# EAGLE schematic ControlBoard (EAGLE 9.4.2)
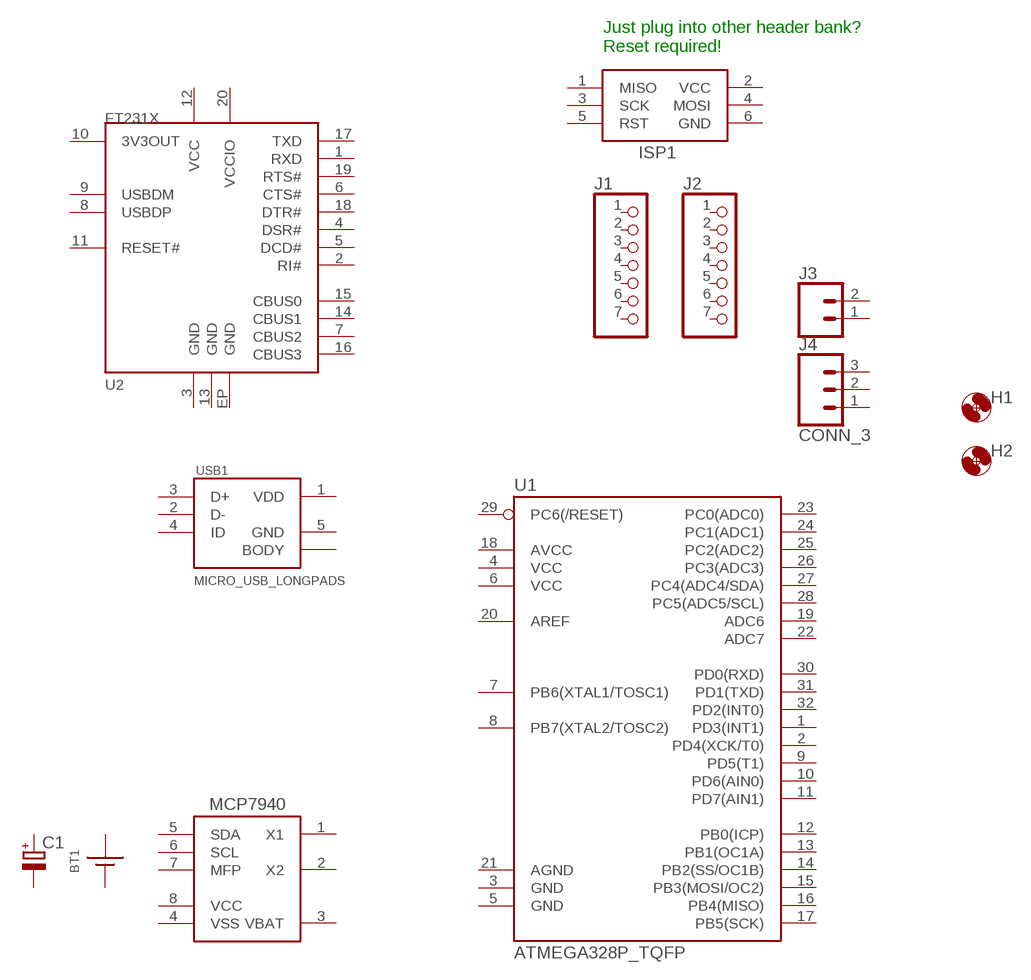
[diagram p0: schematic, sheet 1]

## Parts
BT1  BATTERY_COIN12MM  [LINX_BAT-HLD-012-SMT]
C1  CPOL-EUE2.5-6  [E2,5-6]
H1  MOUNTING_HOLE2_NP  [2_56]
H2  MOUNTING_HOLE2_NP  [2_56]
ISP1  AVRISP-6  [AVRISP]
J1  CONN_7  [1X07]
J2  CONN_7  [1X07]
J3  CONN_02  [1X02]
J4  CONN_3  [1X03]
U1  ATMEGA328P_TQFP  ATMEGA328P_TQFPTQFP_32  [TQFP32-08]
U2  FT231X-Q  [QFN20]
U$1  MCP7940SOIC  [SO08]
USB1  MICRO_USB_LONGPADS  [10118194-0001LF_10118194-0001LF_LONGER_PADS]
Unconnected: BT1.GND(-) BT1.POWER0(+) BT1.POWER1(+) C1.+ C1.- ISP1.1(MISO) ISP1.3(SCK) ISP1.4(MOSI) ISP1.5(RST) J1.1 J1.2 J1.3 J1.4 J1.5 J1.6 J1.7 J2.1 J2.2 J2.3 J2.4 J2.5 J2.6 J2.7 J3.1 J3.2 J4.1 J4.2 J4.3 U1.1(PD3(INT1)) U1.2(PD4(XCK/T0)) U1.3(GND) U1.4(VCC) U1.5(GND) U1.6(VCC) U1.7(PB6(XTAL1/TOSC1)) U1.8(PB7(XTAL2/TOSC2)) U1.9(PD5(T1)) U1.10(PD6(AIN0)) U1.11(PD7(AIN1)) U1.12(PB0(ICP)) U1.13(PB1(OC1A)) U1.14(PB2(SS/OC1B)) U1.15(PB3(MOSI/OC2)) U1.16(PB4(MISO)) U1.17(PB5(SCK)) U1.18(AVCC) U1.19(ADC6) U1.20(AREF) U1.21(AGND) U1.22(ADC7) U1.23(PC0(ADC0)) U1.24(PC1(ADC1)) U1.25(PC2(ADC2)) U1.26(PC3(ADC3)) U1.27(PC4(ADC4/SDA)) U1.28(PC5(ADC5/SCL)) U1.29(PC6(/RESET)) U1.30(PD0(RXD)) U1.31(PD1(TXD)) U1.32(PD2(INT0)) U2.1(RXD) U2.2(RI#) U2.3(GND) U2.4(DSR#) U2.5(DCD#) U2.6(CTS#) U2.7(CBUS2) U2.8(USBDP) U2.9(USBDM) U2.10(3V3OUT) U2.11(RESET#) U2.12(VCC) U2.13(GND) U2.14(CBUS1) U2.15(CBUS0) U2.16(CBUS3) U2.17(TXD) U2.18(DTR#) U2.19(RTS#) U2.20(VCCIO) U2.EP(GND) U$1.1(X1) U$1.2(X2) U$1.3(VBAT) U$1.4(VSS) U$1.5(SDA) U$1.6(SCL) U$1.7(MFP) U$1.8(VCC) USB1.2(D-) USB1.3(D+) USB1.4(ID) USB1.BODY@1(BODY) USB1.BODY@2(BODY) USB1.BODY@3(BODY) USB1.BODY@4(BODY) USB1.BODY@7(BODY) USB1.BODY@8(BODY)

## Notes on the sheet
- Just plug into other header bank?
  Reset required!

## Power pins joined to a net without a drawn wire
GND: ISP1.6(GND) USB1.5(GND)
VCC: ISP1.2(VCC)
VDD: USB1.1(VDD)

## Library data of the parts
BT1 = bschulz:BATTERY_COIN: Coin Cell Battery Holder; DIGIKEY: BAT-HLD-012-SMT-ND; MF: Linx; MPN: BAT-HLD-012-SMT
C1 = bschulz_passives:CPOL-EU: POLARIZED CAPACITOR, European symbol; SPICEPREFIX: C
H1 H2 = bschulz:MOUNTING_HOLE: Genaric Mechanical Mounting Hole Hole diameter based on max body diameter + 15% Keepout ring is for diameter of socket cap screw (minimum required clearance) TPlace ring is for diameter of pan head screw (recomended clearance) Specifications: Socket Cap <http://fastener-express.com/fastener-technical/SocketscapSS-Alloy.pdf> Button Head Socket Cap <http://fastener-express.com/fastener-technical/Button-Socket-alloy.pdf> Pan Head <http://fastener-express.com/fastener-technical/pan-machine-Screws.pdf>
ISP1 = bschulz:AVRISP: AVR ISP HEADER Standard 6 pin header for AVR programming
J1 J2 = bschulz:CONN_7: Genaric 7 terminal header
J3 = bschulz:CONN_02: Genaric 2 terminal header SCREW_2.54 <https://www.digikey.com/product-detail/en/on-shore-technology-inc/OSTVN02A150/ED10561-ND/1588862>
J4 = bschulz:CONN_3: Genaric 3 terminal header Digikey 2.54_SCREW <https://www.digikey.com/product-detail/en/on-shore-technology-inc/OSTVN03A150/ED10562-ND/1588863> 3.5_SCREW <https://www.digikey.com/product-detail/en/on-shore-technology-inc/OSTTE030161/ED2636-ND/614585>
U1 = bschulz:ATMEGA328P_TQFP: Popular 328P in QFP Storefront component: ATmega328 - TQFP <https://www.sparkfun.com/products/13448> (COM-13448) Datasheet <http://www.sparkfun.com/datasheets/Components/SMD/ATMega328.pdf> SparkFun Products SparkFun RedBoard - Programmed with Arduino <https://www.sparkfun.com/products/12757> (DEV-12757) Arduino Pro Mini 328 - 5V/16MHz <https://www.sparkfun.com/products/11113> (DEV-11113) Arduino Pro Mini 328 - 3.3V/8MHz <https://www.sparkfun.com/products/11114> (DEV-11114) SparkFun OpenLog <https://www.sparkfun.com/products/13712> (DEV-13712) SparkFun MicroView - OLED Arduino Module <https://www.sparkfun.com/products/12923> (DEV-12923) SparkFun Digital Sandbox <https://www.sparkfun.com/products/12651> (DEV-12651) SparkFun PicoBoard <https://www.sparkfun.com/products/11888> (WIG-11888) Arduino Fio <https://www.sparkfun.com/products/10116> (DEV-10116) LilyPad Arduino 328 Main Board <https://www.sparkfun.com/products/13342> (DEV-13342) SparkFun RedStick <https://www.sparkfun.com/products/13741> (DEV-13741) LilyPad MP3 <https://www.sparkfun.com/products/11013> (DEV-11013) LilyPad Arduino SimpleSnap <https://www.sparkfun.com/products/10941> (DEV-10941) SparkFun Stepoko <https://www.sparkfun.com/products/13899> (ROB-13899) SparkFun Geiger Counter <https://www.sparkfun.com/products/11345> (SEN-11345) SparkFun EL Sequencer <https://www.sparkfun.com/products/12781> (COM-12781) Arduino Pro 328 - 5V/16MHz <https://www.sparkfun.com/products/10915> (DEV-10915) CryptoCape <https://www.sparkfun.com/products/12773> (DEV-12773) SparkFun IR Thermometer Evaluation Board - MLX90614 <https://www.sparkfun.com/products/10740> (SEN-10740) SparkFun RedBot Mainboard <https://www.sparkfun.com/products/12097> (ROB-12097) Arduino Pro 328 - 3.3V/8MHz <https://www.sparkfun.com/products/10914> (DEV-10914) SparkFun Block for Intel® Edison - Arduino <https://www.sparkfun.com/products/13036> (DEV-13036) SparkFun Simon Says - Surface Mount Soldering Kit <https://www.sparkfun.com/products/10935> (KIT-10935) SparkFun 7-Segment Serial Display - Red <https://www.sparkfun.com/products/11441> (COM-11441) SparkFun 7-Segment Serial Display - White <https://www.sparkfun.com/products/11629> (COM-11629) SparkFun 7-Segment Serial Display - Yellow <https://www.sparkfun.com/products/11443> (COM-11443) SparkFun 7-Segment Serial Display - Kelly Green <https://www.sparkfun.com/products/11440> (COM-11440) SparkFun 7-Segment Serial Display - Blue <https://www.sparkfun.com/products/11442> (COM-11442) SparkFun OpenSegment Serial Display - 20mm (Blue) <https://www.sparkfun.com/products/11647> (COM-11647) SparkFun OpenSegment Serial Display - 20mm (Green) <https://www.sparkfun.com/products/11646> (COM-11646) SparkFun OpenSegment Serial Display - 20mm (White) <https://www.sparkfun.com/products/11648> (COM-11648) SparkFun OpenSegment Serial Display - 20mm (Red) <https://www.sparkfun.com/products/11644> (COM-11644) SparkFun OpenSegment Serial Display - 20mm (Yellow) <https://www.sparkfun.com/products/11645> (COM-11645) SparkFun OpenSegment Shield <https://www.sparkfun.com/products/13190> (DEV-13190); DIGIKEY: ATMEGA328PB-AURCT-ND; MF: Atmel; MPN: ATMEGA328PB-AUR; PROD_ID: IC-09069
U2 = bschulz:FT231X: FT231x - USB to UART Bridge Characteristics: Vin: 3.3V ~ 5V Operating Temperature: -40°C to 85°C Digikey: FT231x <https://www.digikey.com/product-detail/en/ftdi-future-technology-devices-international-ltd/FT231XQ-R/768-1128-1-ND/3029153>; DIGIKEY: 768-1128-1-ND; MF: FTDI; MPN: FT231XQ-R
U$1 = bschulz:MCP7940: MCP7940 - RTC Characteristics: VCC: 1.8~5.5V VBat: 1.3~5.5V Memory: 64B Interface: I2C Operating Temperature: -40°C to 85°C Digikey: MCP7940N-I/SN-ND <https://www.digikey.com/scripts/DkSearch/dksus.dll?Detail&itemSeq=257151033&uq=636590618847128166> Pin Compatible Alternatives <https://www.digikey.com/products/en/integrated-circuits-ics/clock-timing-real-time-clocks/690?FV=401994%2C26802e4%2C45003ef%2C450041e%2C4500072%2C450050c%2C4500565%2C450057c%2C450057e%2C4500010%2C4500011%2C4500017%2C450017d%2C4500180%2C450004f%2C1f140000%2Cffe002b2%2C16980015%2C1698001a%2C1698001d%2C16980026%2C16980027%2C16980029%2C16980036%2C16980009&quantity=10&ColumnSort=1000011&page=2&stock=1&nstock=1&pageSize=25> Note: These are recomendations at the time, always verify pin compatability using combination of Mrk1 EyeBall and quality datasheet; DIGIKEY: MCP7940N-I/SN-ND; MF: Microchip; MPN: MCP7940N-I/SN
USB1 = bschulz:MICRO_USB_LONGPADS; DIGIKEY: 609-4618-1-ND; MF: Amphenol; MPN: 10118194-0001LF